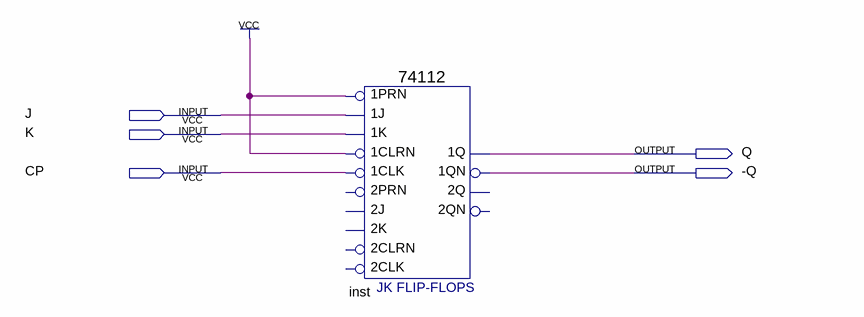
[diagram p0: schematic sheet]
// Quartus schematic JK.bdf as structural Verilog: 1 symbols, 5 pins
module JK (
  input  J,
  input  K,
  input  CP,
  output Q,
  output \-Q 
);

  \74112  inst (
    .\1K (K), .\1J (J), .\1PRN (1'b1), .\1CLK (CP), .\1CLRN (1'b1), .\1QN (\-Q ), .\1Q (Q));  // open: 2K, 2J, 2PRN, 2CLK, 2CLRN, 2Q, 2QN
endmodule
